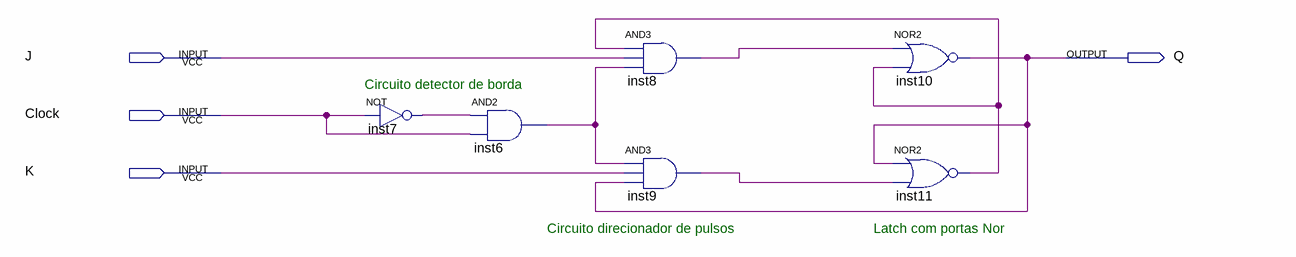
[diagram p0: schematic sheet]
// Quartus schematic Flip-flop_JK.bdf as structural Verilog: 6 symbols, 4 pins
module \Flip-flop_JK  (
  input  J,
  input  Clock,
  input  K,
  output Q
);

  wire inst6_out, inst7_out, inst8_out, inst9_out, inst11_out;

  not inst7 (inst7_out, Clock);
  and inst6 (inst6_out, inst7_out, Clock);
  and inst8 (inst8_out, inst11_out, J, inst6_out);
  and inst9 (inst9_out, inst6_out, K, Q);
  nor inst10 (Q, inst8_out, inst11_out);
  nor inst11 (inst11_out, Q, inst9_out);

  // Notes on the sheet:
  //   Circuito detector de borda
  //   Circuito direcionador de pulsos
  //   Latch com portas Nor
endmodule
